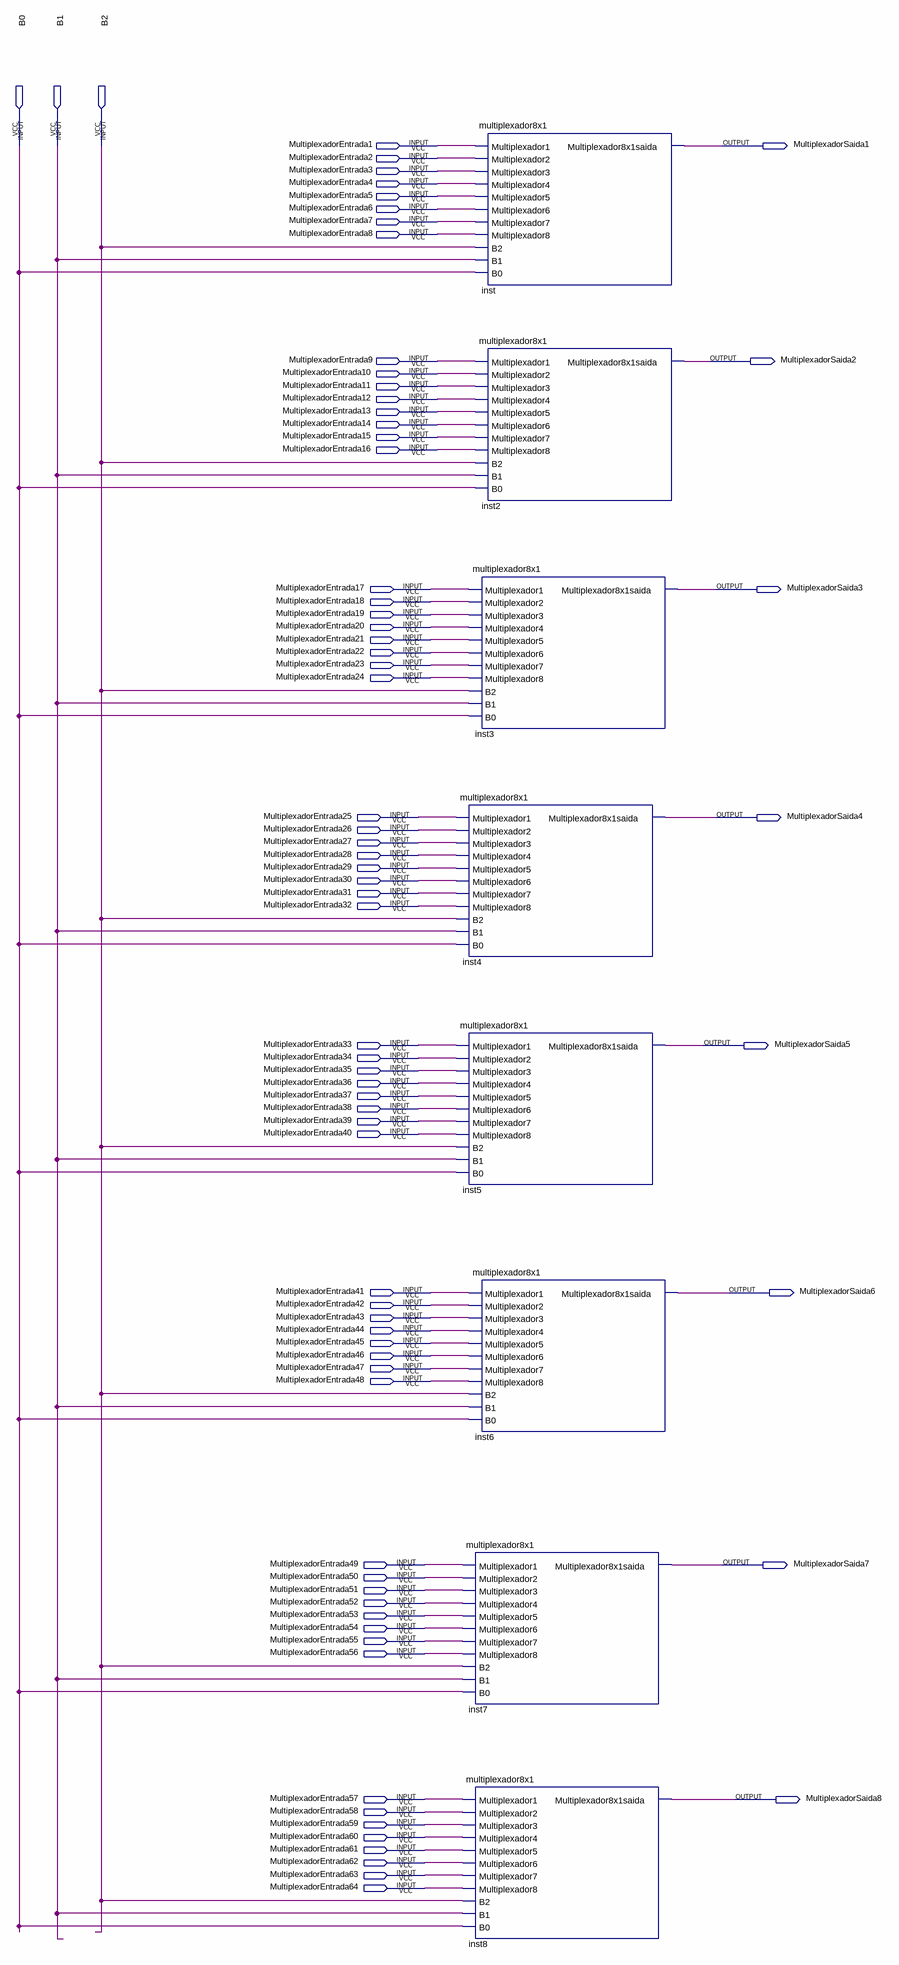
[diagram p0: schematic sheet]
// Quartus schematic Multiplexador64x8.bdf as structural Verilog: 8 symbols, 75 pins
module Multiplexador64x8 (
  input  B0,
  input  B1,
  input  B2,
  input  MultiplexadorEntrada1,
  input  MultiplexadorEntrada2,
  input  MultiplexadorEntrada3,
  input  MultiplexadorEntrada4,
  input  MultiplexadorEntrada5,
  input  MultiplexadorEntrada6,
  input  MultiplexadorEntrada7,
  input  MultiplexadorEntrada8,
  input  MultiplexadorEntrada9,
  input  MultiplexadorEntrada10,
  input  MultiplexadorEntrada11,
  input  MultiplexadorEntrada12,
  input  MultiplexadorEntrada13,
  input  MultiplexadorEntrada14,
  input  MultiplexadorEntrada15,
  input  MultiplexadorEntrada16,
  input  MultiplexadorEntrada17,
  input  MultiplexadorEntrada18,
  input  MultiplexadorEntrada19,
  input  MultiplexadorEntrada20,
  input  MultiplexadorEntrada21,
  input  MultiplexadorEntrada22,
  input  MultiplexadorEntrada23,
  input  MultiplexadorEntrada24,
  input  MultiplexadorEntrada25,
  input  MultiplexadorEntrada26,
  input  MultiplexadorEntrada27,
  input  MultiplexadorEntrada28,
  input  MultiplexadorEntrada29,
  input  MultiplexadorEntrada30,
  input  MultiplexadorEntrada31,
  input  MultiplexadorEntrada32,
  input  MultiplexadorEntrada33,
  input  MultiplexadorEntrada34,
  input  MultiplexadorEntrada35,
  input  MultiplexadorEntrada36,
  input  MultiplexadorEntrada37,
  input  MultiplexadorEntrada38,
  input  MultiplexadorEntrada39,
  input  MultiplexadorEntrada40,
  input  MultiplexadorEntrada41,
  input  MultiplexadorEntrada42,
  input  MultiplexadorEntrada43,
  input  MultiplexadorEntrada44,
  input  MultiplexadorEntrada45,
  input  MultiplexadorEntrada46,
  input  MultiplexadorEntrada47,
  input  MultiplexadorEntrada48,
  input  MultiplexadorEntrada49,
  input  MultiplexadorEntrada50,
  input  MultiplexadorEntrada51,
  input  MultiplexadorEntrada52,
  input  MultiplexadorEntrada53,
  input  MultiplexadorEntrada54,
  input  MultiplexadorEntrada55,
  input  MultiplexadorEntrada56,
  input  MultiplexadorEntrada57,
  input  MultiplexadorEntrada58,
  input  MultiplexadorEntrada59,
  input  MultiplexadorEntrada60,
  input  MultiplexadorEntrada61,
  input  MultiplexadorEntrada62,
  input  MultiplexadorEntrada63,
  input  MultiplexadorEntrada64,
  output MultiplexadorSaida1,
  output MultiplexadorSaida2,
  output MultiplexadorSaida3,
  output MultiplexadorSaida4,
  output MultiplexadorSaida5,
  output MultiplexadorSaida6,
  output MultiplexadorSaida7,
  output MultiplexadorSaida8
);

  multiplexador8x1 inst4 (
    .Multiplexador1(MultiplexadorEntrada25), .Multiplexador2(MultiplexadorEntrada26),
    .Multiplexador3(MultiplexadorEntrada27), .Multiplexador4(MultiplexadorEntrada28),
    .Multiplexador5(MultiplexadorEntrada29), .Multiplexador6(MultiplexadorEntrada30),
    .Multiplexador7(MultiplexadorEntrada31), .Multiplexador8(MultiplexadorEntrada32), .B2(B2), .B1(B1),
    .B0(B0), .Multiplexador8x1saida(MultiplexadorSaida4));
  multiplexador8x1 inst5 (
    .Multiplexador1(MultiplexadorEntrada33), .Multiplexador2(MultiplexadorEntrada34),
    .Multiplexador3(MultiplexadorEntrada35), .Multiplexador4(MultiplexadorEntrada36),
    .Multiplexador5(MultiplexadorEntrada37), .Multiplexador6(MultiplexadorEntrada38),
    .Multiplexador7(MultiplexadorEntrada39), .Multiplexador8(MultiplexadorEntrada40), .B2(B2), .B1(B1),
    .B0(B0), .Multiplexador8x1saida(MultiplexadorSaida5));
  multiplexador8x1 inst7 (
    .Multiplexador1(MultiplexadorEntrada49), .Multiplexador2(MultiplexadorEntrada50),
    .Multiplexador3(MultiplexadorEntrada51), .Multiplexador4(MultiplexadorEntrada52),
    .Multiplexador5(MultiplexadorEntrada53), .Multiplexador6(MultiplexadorEntrada54),
    .Multiplexador7(MultiplexadorEntrada55), .Multiplexador8(MultiplexadorEntrada56), .B2(B2), .B1(B1),
    .B0(B0), .Multiplexador8x1saida(MultiplexadorSaida7));
  multiplexador8x1 inst8 (
    .Multiplexador1(MultiplexadorEntrada57), .Multiplexador2(MultiplexadorEntrada58),
    .Multiplexador3(MultiplexadorEntrada59), .Multiplexador4(MultiplexadorEntrada60),
    .Multiplexador5(MultiplexadorEntrada61), .Multiplexador6(MultiplexadorEntrada62),
    .Multiplexador7(MultiplexadorEntrada63), .Multiplexador8(MultiplexadorEntrada64), .B2(B2), .B1(B1),
    .B0(B0), .Multiplexador8x1saida(MultiplexadorSaida8));
  multiplexador8x1 inst (
    .Multiplexador1(MultiplexadorEntrada1), .Multiplexador2(MultiplexadorEntrada2),
    .Multiplexador3(MultiplexadorEntrada3), .Multiplexador4(MultiplexadorEntrada4),
    .Multiplexador5(MultiplexadorEntrada5), .Multiplexador6(MultiplexadorEntrada6),
    .Multiplexador7(MultiplexadorEntrada7), .Multiplexador8(MultiplexadorEntrada8), .B2(B2), .B1(B1),
    .B0(B0), .Multiplexador8x1saida(MultiplexadorSaida1));
  multiplexador8x1 inst2 (
    .Multiplexador1(MultiplexadorEntrada9), .Multiplexador2(MultiplexadorEntrada10),
    .Multiplexador3(MultiplexadorEntrada11), .Multiplexador4(MultiplexadorEntrada12),
    .Multiplexador5(MultiplexadorEntrada13), .Multiplexador6(MultiplexadorEntrada14),
    .Multiplexador7(MultiplexadorEntrada15), .Multiplexador8(MultiplexadorEntrada16), .B2(B2), .B1(B1),
    .B0(B0), .Multiplexador8x1saida(MultiplexadorSaida2));
  multiplexador8x1 inst3 (
    .Multiplexador1(MultiplexadorEntrada17), .Multiplexador2(MultiplexadorEntrada18),
    .Multiplexador3(MultiplexadorEntrada19), .Multiplexador4(MultiplexadorEntrada20),
    .Multiplexador5(MultiplexadorEntrada21), .Multiplexador6(MultiplexadorEntrada22),
    .Multiplexador7(MultiplexadorEntrada23), .Multiplexador8(MultiplexadorEntrada24), .B2(B2), .B1(B1),
    .B0(B0), .Multiplexador8x1saida(MultiplexadorSaida3));
  multiplexador8x1 inst6 (
    .Multiplexador1(MultiplexadorEntrada41), .Multiplexador2(MultiplexadorEntrada42),
    .Multiplexador3(MultiplexadorEntrada43), .Multiplexador4(MultiplexadorEntrada44),
    .Multiplexador5(MultiplexadorEntrada45), .Multiplexador6(MultiplexadorEntrada46),
    .Multiplexador7(MultiplexadorEntrada47), .Multiplexador8(MultiplexadorEntrada48), .B2(B2), .B1(B1),
    .B0(B0), .Multiplexador8x1saida(MultiplexadorSaida6));
endmodule
